# EAGLE design PAGE1 (EAGLE 9.6.0)
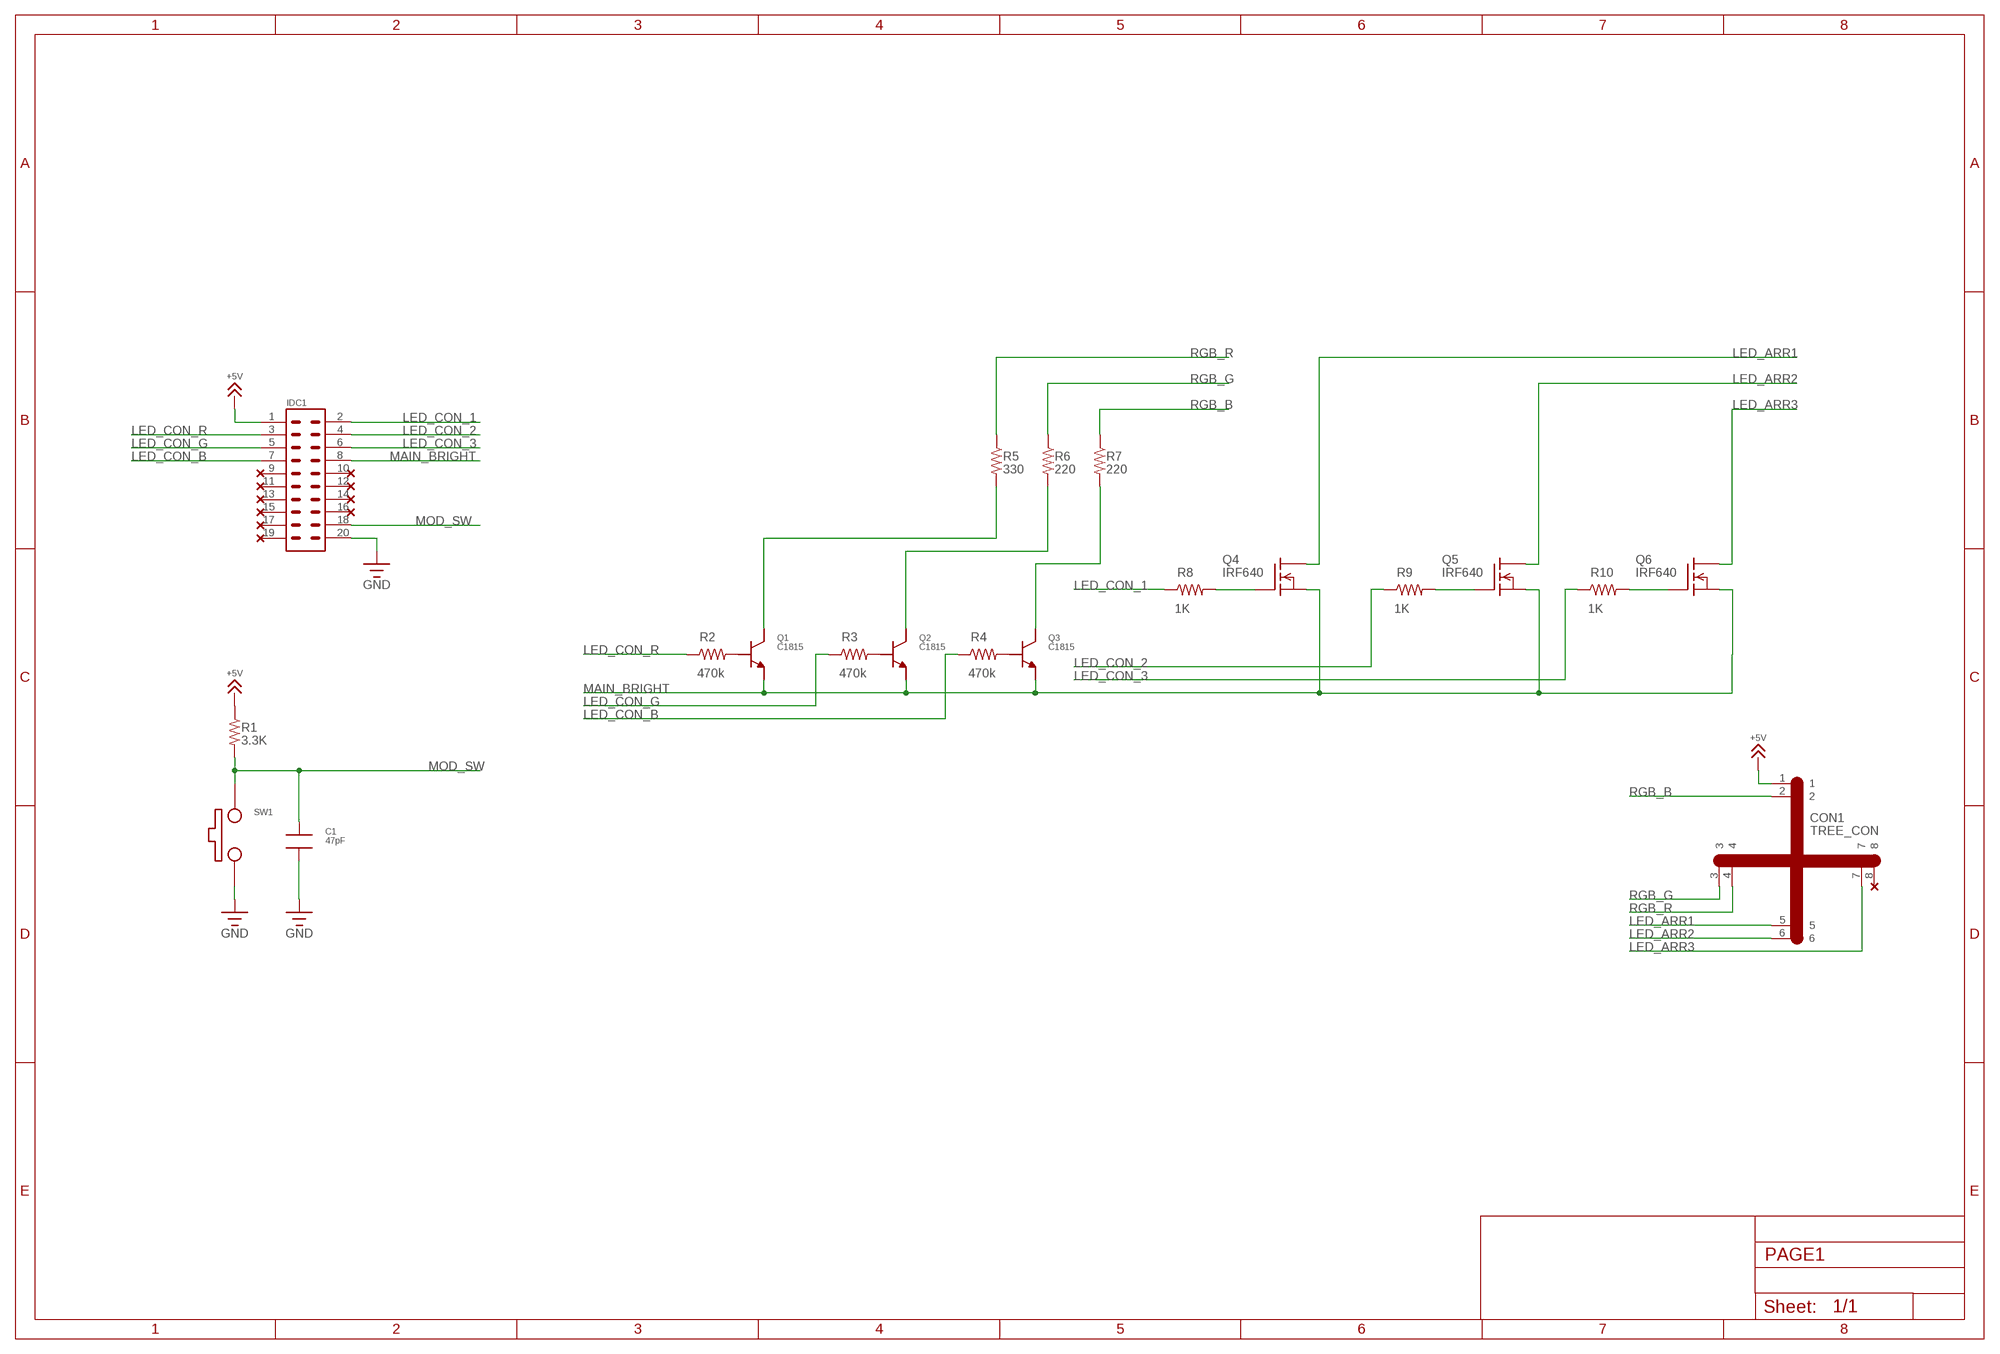
[diagram p0: schematic, sheet 1]

## Parts
C1  47pF  CAP_NP_SMD2012  [SMD2012]
CON1  TREE_CON  [TREE_CON]
IDC1  IDC20_BEN  [IDC20_BENDING]
Q1  C1815  NPN  [TO92]
Q2  C1815  NPN  [TO92]
Q3  C1815  NPN  [TO92]
Q4  IRF640  IRF620  [TO220]
Q5  IRF640  IRF620  [TO220]
Q6  IRF640  IRF620  [TO220]
R1  3.3K  RES_2012  [SMD2012]
R2  470k  RES_2012  [SMD2012]
R3  470k  RES_2012  [SMD2012]
R4  470k  RES_2012  [SMD2012]
R5  330  RES_2012  [SMD2012]
R6  220  RES_2012  [SMD2012]
R7  220  RES_2012  [SMD2012]
R8  1K  RES_2012  [SMD2012]
R9  1K  RES_2012  [SMD2012]
R10  1K  RES_2012  [SMD2012]
SW1  PUSH_SW  [PUSH_SW]

## Nets
+5V [POWER]: CON1.1 IDC1.1 R1.1
GND [POWER]: C1.2 IDC1.20 SW1.P$1
LED_ARR1: CON1.5 Q4.2(D)
LED_ARR2: CON1.6 Q5.2(D)
LED_ARR3: CON1.7 Q6.2(D)
LED_CON_1: IDC1.2 R8.1
LED_CON_2: IDC1.4 R9.1
LED_CON_3: IDC1.6 R10.1
LED_CON_B: IDC1.7 R4.1
LED_CON_G: IDC1.5 R3.1
LED_CON_R: IDC1.3 R2.1
MAIN_BRIGHT: IDC1.8 Q1.1(E) Q2.1(E) Q3.1(E) Q4.3(S) Q5.3(S) Q6.3(S)
MOD_SW: C1.1 IDC1.18 R1.2 SW1.P$2
N$13: Q4.1(G) R8.2
N$43: Q5.1(G) R9.2
N$46: Q6.1(G) R10.2
N$50: Q1.3(B) R2.2
N$53: Q2.3(B) R3.2
N$54: Q3.3(B) R4.2
N$55: Q1.2(C) R5.2
N$56: Q2.2(C) R6.2
N$57: Q3.2(C) R7.2
RGB_B: CON1.2 R7.1
RGB_G: CON1.3 R6.1
RGB_R: CON1.4 R5.1
Unconnected: CON1.8 IDC1.9 IDC1.10 IDC1.11 IDC1.12 IDC1.13 IDC1.14 IDC1.15 IDC1.16 IDC1.17 IDC1.19

## Library data of the parts
C1 = !JKS:CAP_NP
CON1 = !JKS:TREE_CON
IDC1 = !JKS:IDC20
Q1-Q3 = !JKS:NPN
Q4-Q6 = transistor-fet:IRF620: N-Channel Enhancement MOSFET (HEXFET); 200V; 5,2A; 0,8Ohm
R1-R10 = !JKS:RES
SW1 = !JKS:PUSH_SW

## Net classes
0 default: width 0.254 mm
1 POWER: width 0.3 mm

## Board
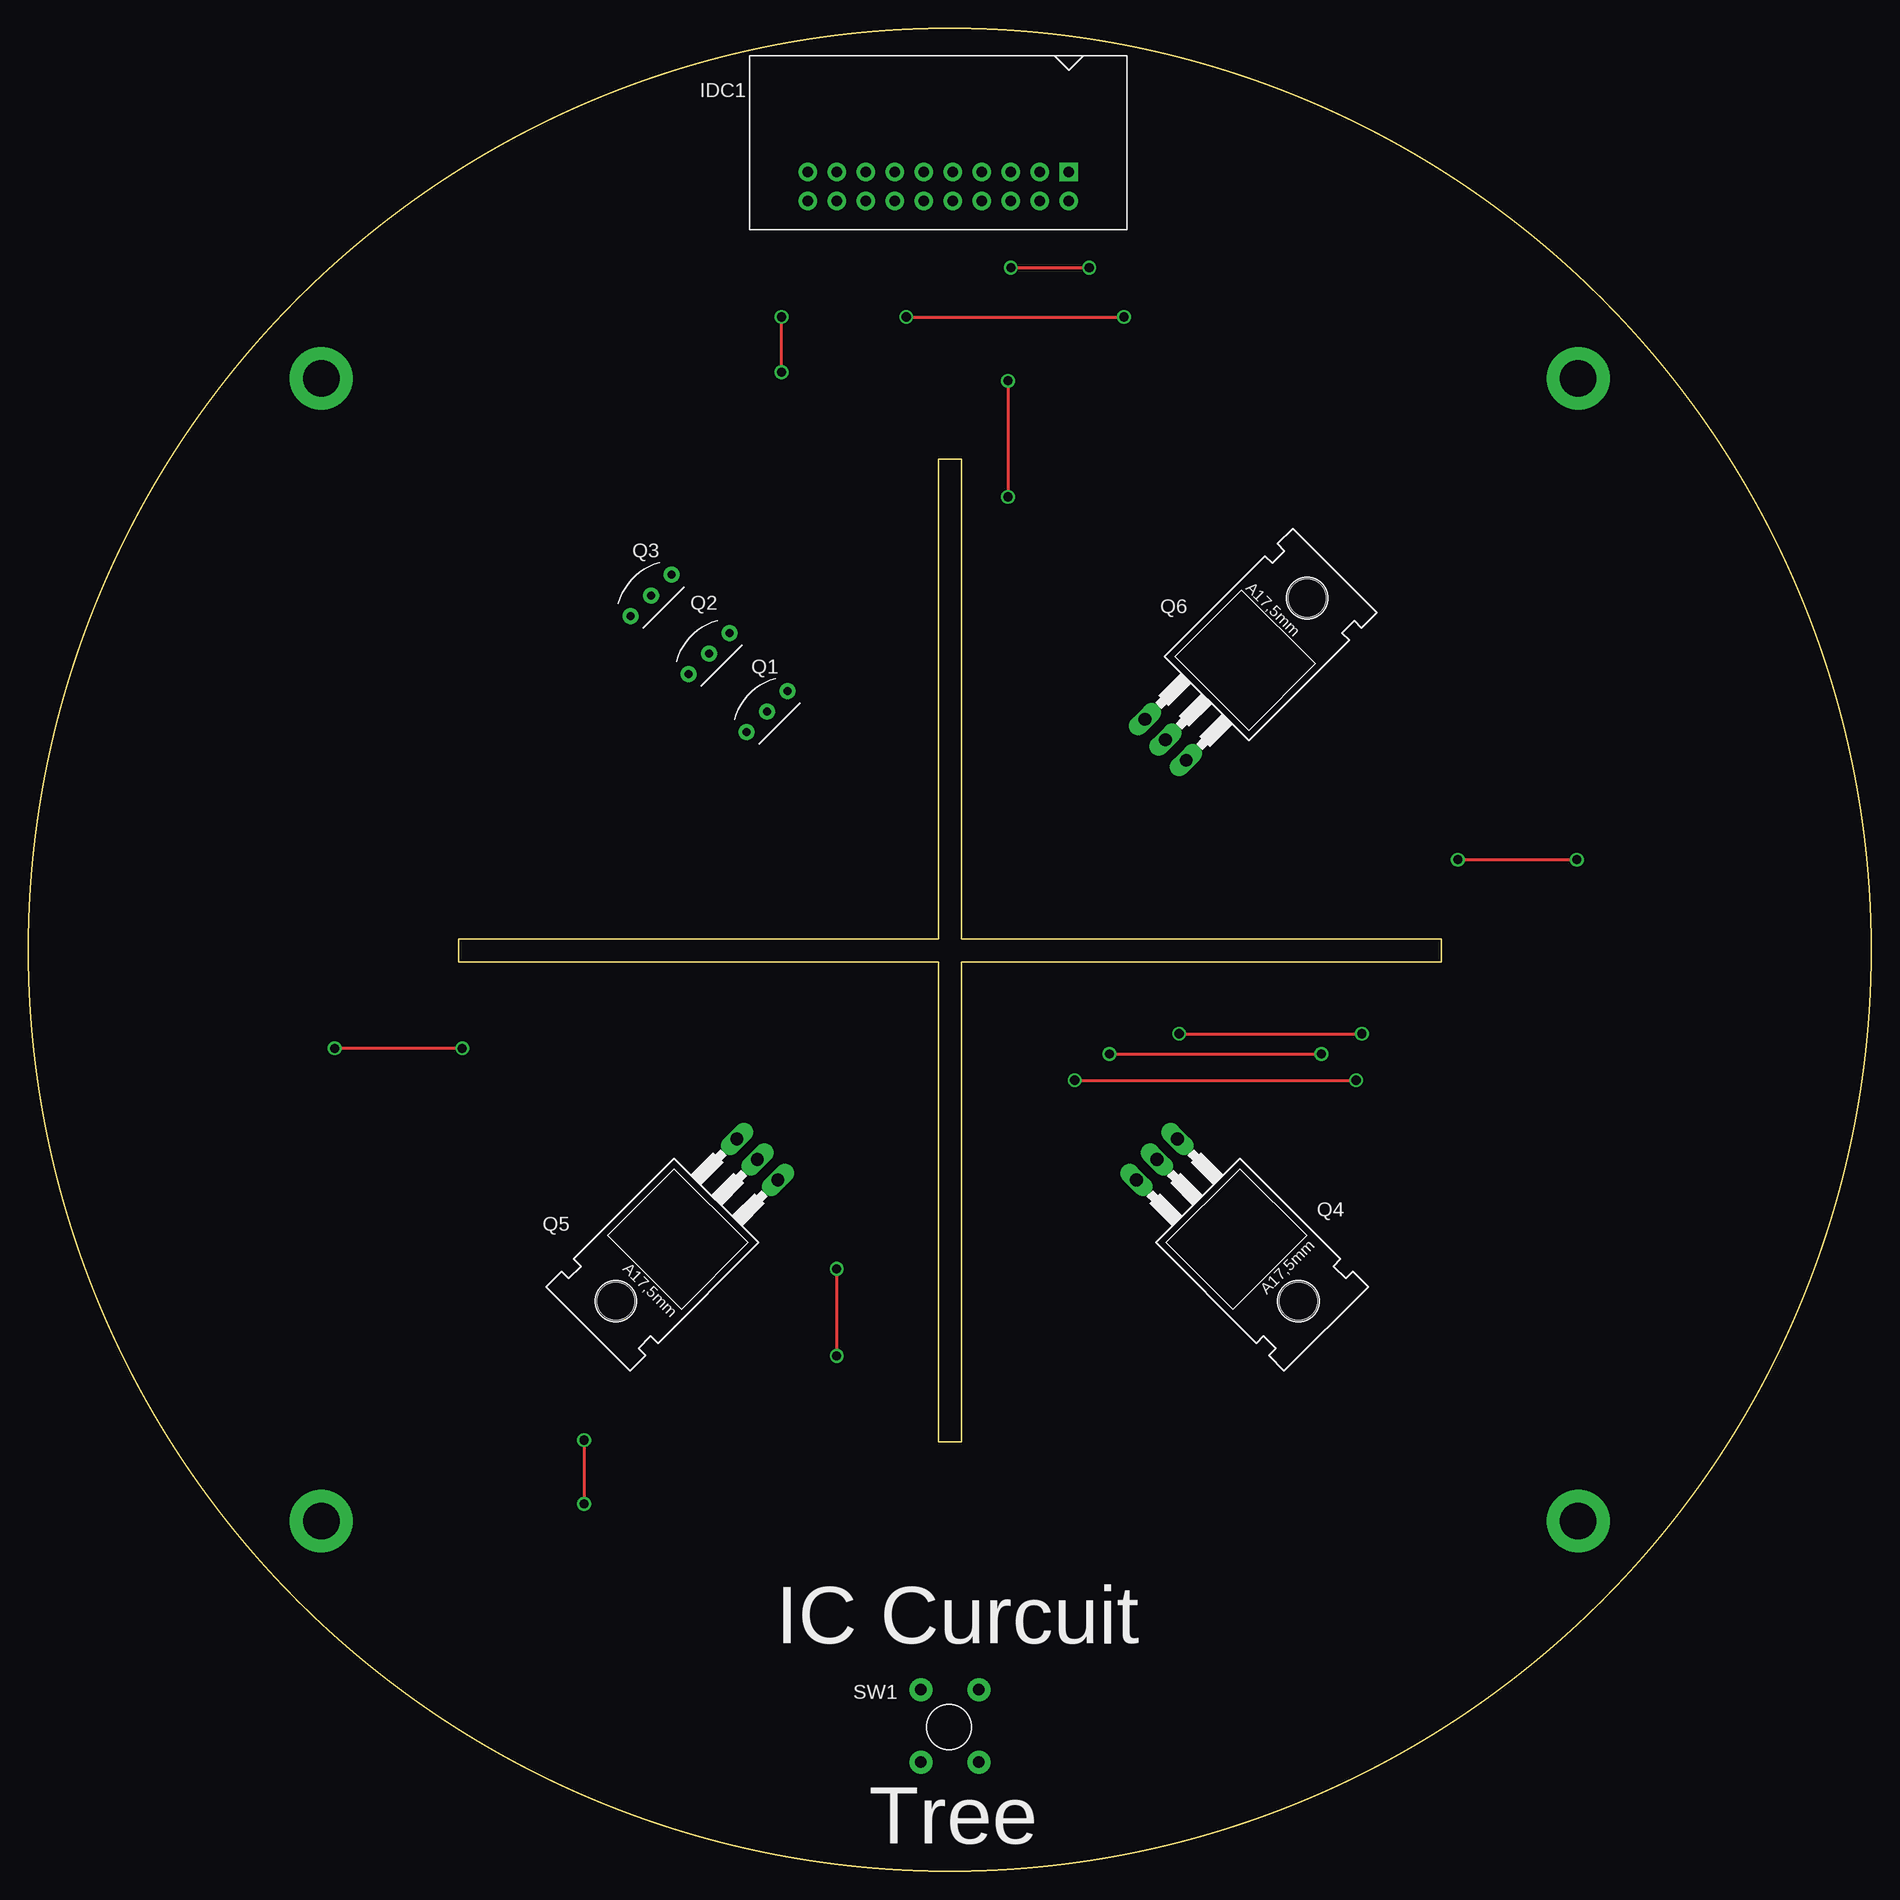
[diagram p1: board, top side]
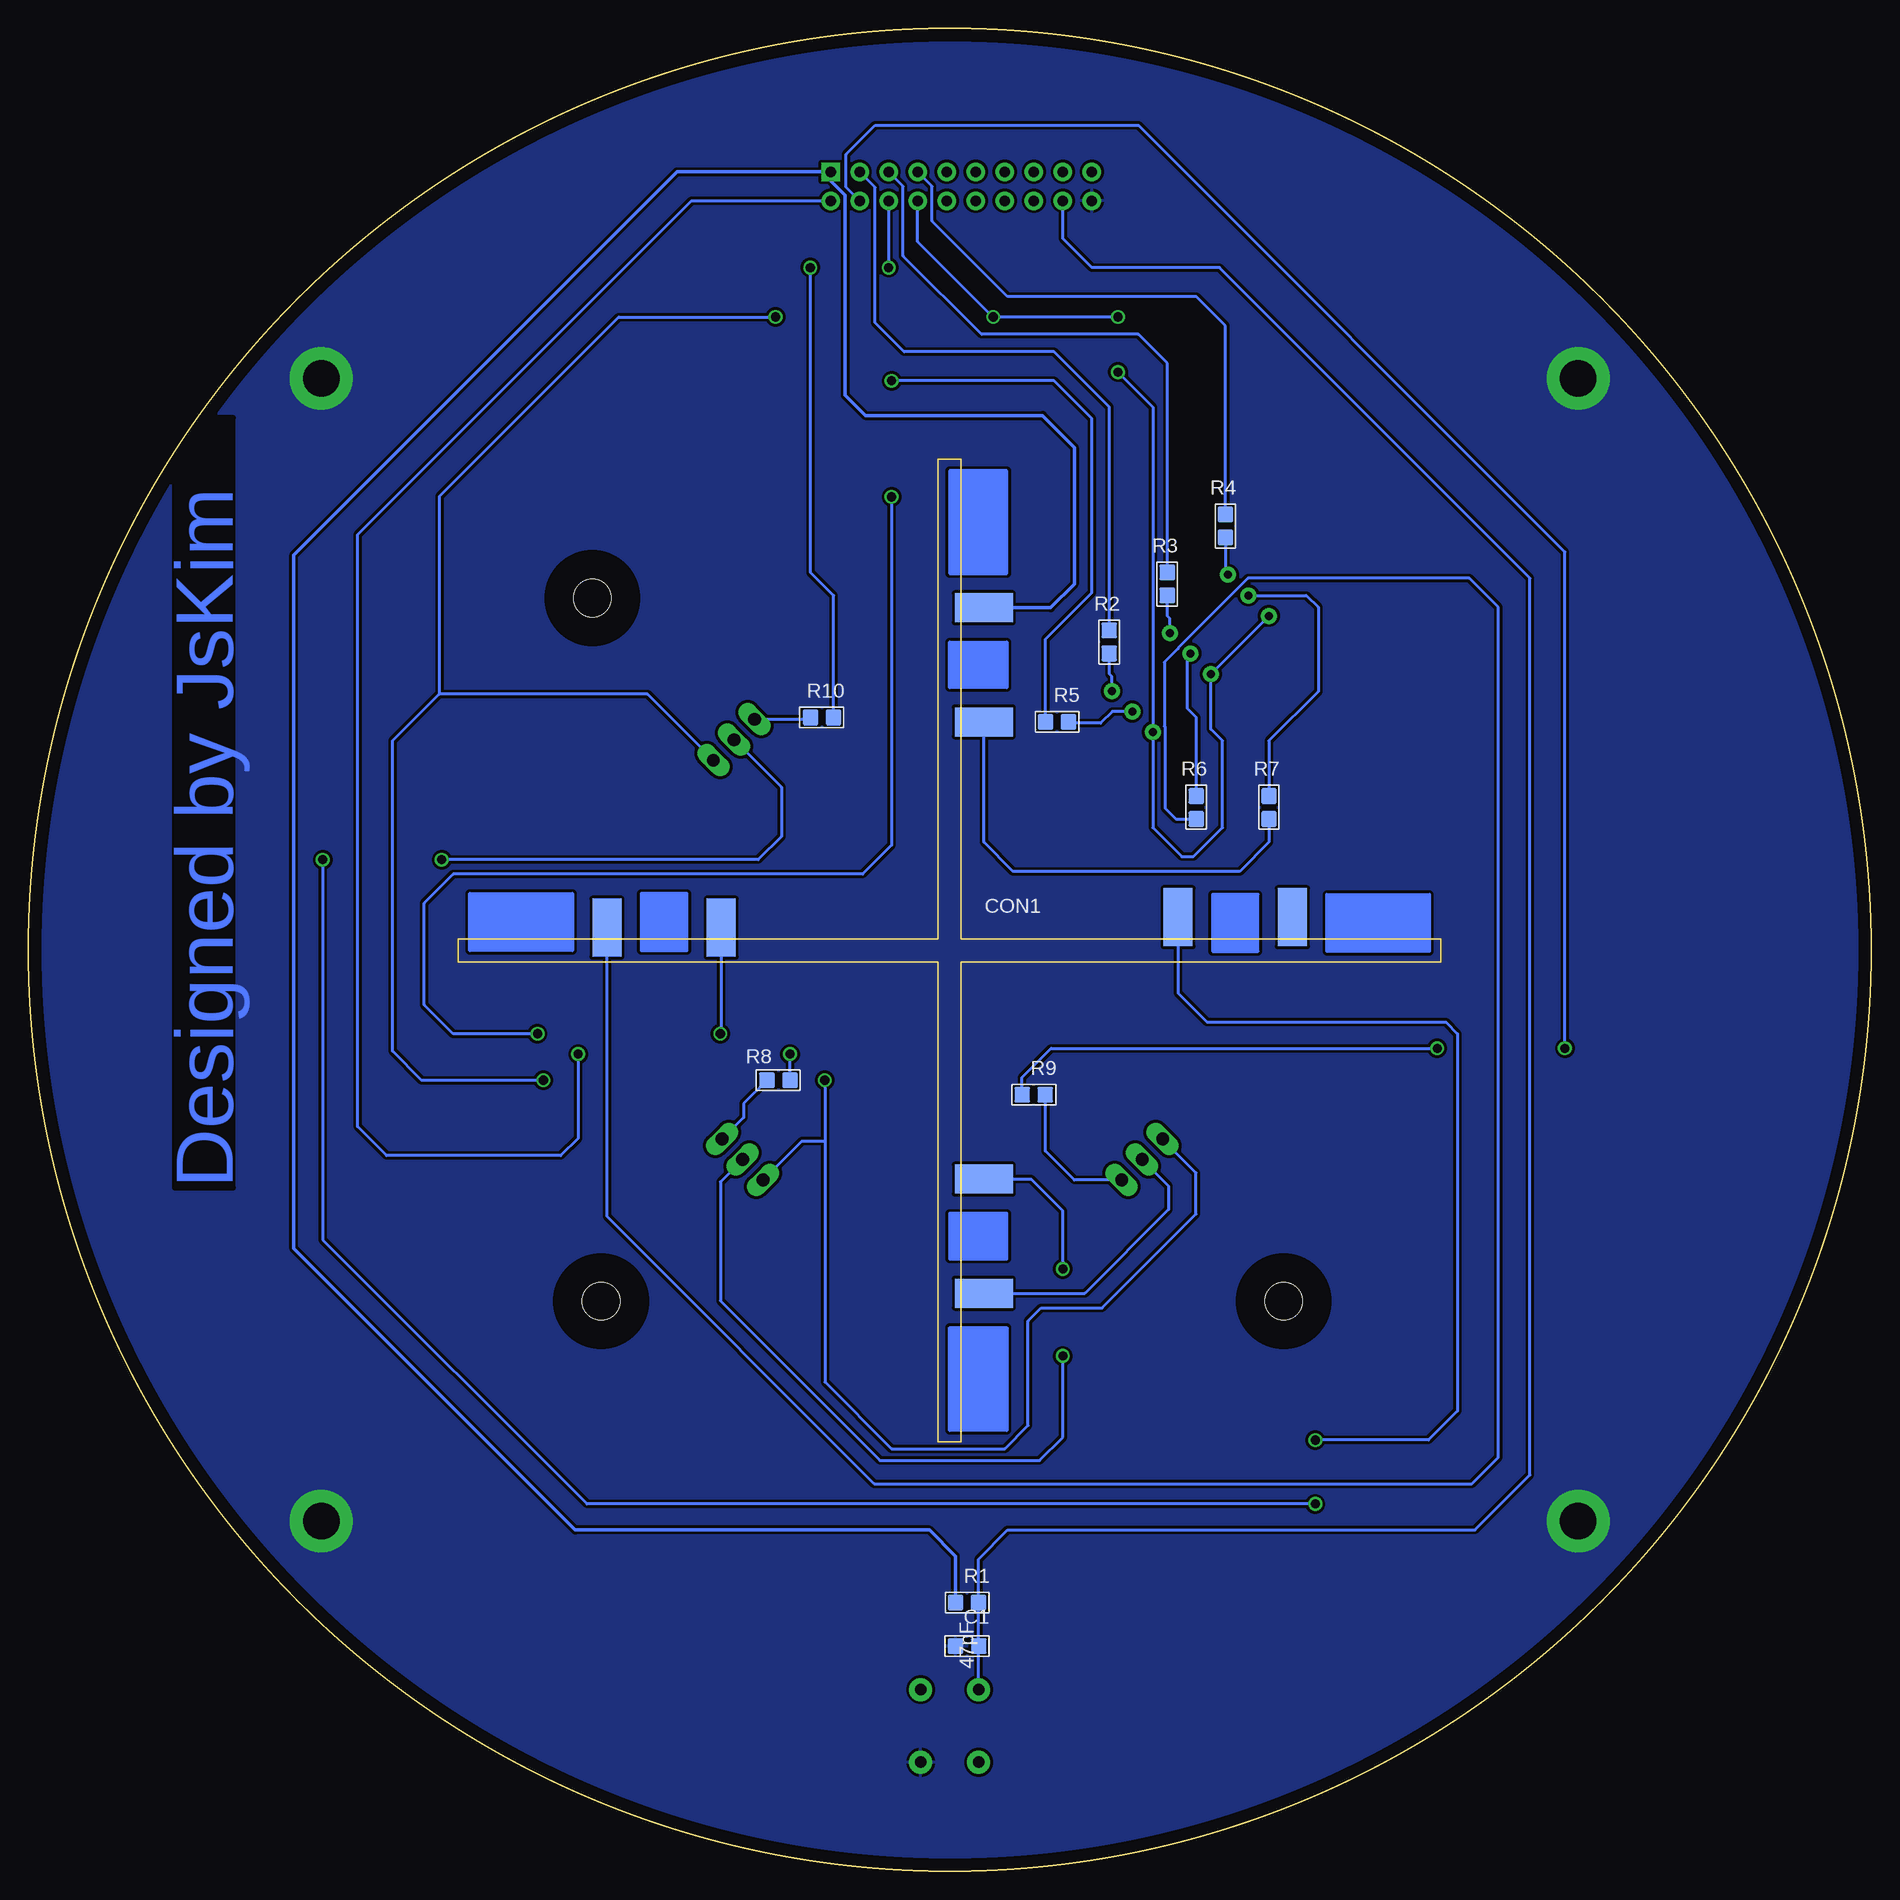
[diagram p2: board, bottom side, seen from below]

Size 161.25 x 161.25 mm. Coordinates in mm from the lower left corner, seen from the top.
Outline: circle at 80.62,80.62 radius 80.62
Copper layers (1*16): Top 0.035mm / dielectric 0.15mm / Bottom 0.035mm
Design rules "default *": minimum track width 10mil, minimum drill 0.35mm, track to track 10mil, track to pad 10mil, pad to pad 6mil, via to via 10mil, smd to smd 10mil, copper to edge 40mil, drill to drill 6mil, minimum pad ring 10mil, minimum via ring 8mil, stop-mask expansion 4mil, vias tented up to drill 0mil, thermal gap 10mil

### Footprints (pad centres in the part's own frame; a part is rotated, then mirrored left to right if it is on the bottom)
SMD2012 = smd 1.4 x 1.4: 1 0,0; 2 2.019,0
TREE_CON = smd 5.08 x 2.54: 1 3,30; 2 3,20; 5 3,-20; 6 3,-30 | smd 2.54 x 5.08: 3 -30,2; 4 -20,2; 7 20,2.92; 8 30,2.92
IDC20_BENDING = drill 0.9 pad 1.6 square: 1 0,0 | drill 0.9 pad 1.6: 2 2.54,0; 3 0,-2.54; 4 2.54,-2.54; 5 0,-5.08; 6 2.54,-5.08; 7 0,-7.62; 8 2.54,-7.62; 9 0,-10.16; 10 2.54,-10.16; 11 0,-12.7; 12 2.54,-12.7; 13 0,-15.24; 14 2.54,-15.24; 15 0,-17.78; 16 2.54,-17.78; 17 0,-20.32; 18 2.54,-20.32; 19 0,-22.86; 20 2.54,-22.86
TO92 = drill 0.7 pad 1.4: 1 0,0; 2 0,2.54; 3 0,5.08
TO220 = drill 1.118 long: 1 -2.54,-6.35; 2 0,-6.35; 3 2.54,-6.35 | hole 3.302: 0,11.176
PUSH_SW = drill 1 pad 2: P$1 0,6.35; P$2 5.08,0; P$3 0,0; P$4 5.08,6.35

### Placement (x,y rotation side)
C1  78.09,19.67 180 bottom
CON1  80.63,80.55 0 bottom
IDC1  91.05,148.7 270 top
Q1  62.85,99.68 315 top
Q2  57.77,104.76 315 top
Q3  52.69,109.84 315 top
Q4  103.24,57.77 225 top
Q5  59.3,57.77 135 top
Q6  104,103.49 315 top
R1  80.12,23.48 0 bottom
R2  66.66,108.57 270 bottom
R3  61.58,113.65 270 bottom
R4  56.5,118.73 270 bottom
R5  72.25,100.57 0 bottom
R6  59.04,92.06 90 bottom
R7  52.69,92.06 90 bottom
R8  94.6,69.2 180 bottom
R9  74.28,67.93 0 bottom
R10  90.79,100.95 180 bottom
SW1  83.17,15.86 180 top

### Tracks (layer width: path | path; a pad name or v marks a point on that pad's centre or on a via)
+5V
  Bottom 0.3: CON1.1 71.79,110.55 69.71,112.64 69.71,124.57 72.5,127.37 88,127.37 89.78,129.15 89.78,146.67 91.05,147.94 IDC1.1 104.51,148.7 138.04,115.18 138.04,54.47 113.4,29.83 82.41,29.83 80.12,27.55 R1.1
GND  (via drill 3.2 pad 5.5)
  other vias: 25.62,130.62 135.62,130.62 25.62,30.62 135.62,30.62
  pour Bottom: 0.62,75.62 0.62,80.62 arc-90 80.62,160.62 arc-90 160.62,80.62 160.62,75.62 arc-90 85.62,0.62 80.62,0.62 75.62,0.62 arc-90
LED_ARR1  (via drill 0.8 pad 0.7)
  Top 0.254: v70.73,52.69 v70.73,45.07
  Bottom 0.254: Q4.2 100.7,60.31 100.7,49.9 86.73,35.93 72.76,35.93 70.73,37.96 v70.73,45.07 | v70.73,52.69 70.73,57.77 73.51,60.55 CON1.5
LED_ARR2
  Bottom 0.254: CON1.6 68.8,50.55 61.47,57.88 61.47,59.95 Q5.2
LED_ARR3  (via drill 0.8 pad 0.7)
  Top 0.254: v125.08,88.51 v135.5,88.51 | v48.63,37.71 v48.63,32.12
  Bottom 0.254: Q6.2 95.36,94.86 95.36,90.54 97.4,88.51 v125.08,88.51 | v135.5,88.51 135.5,55.23 112.38,32.12 v48.63,32.12 | CON1.7 60.63,76.82 58.09,74.28 37.2,74.28 36.18,73.27 36.18,40.25 38.72,37.71 v48.63,37.71
LED_CON_1  (via drill 0.8 pad 0.7)
  Top 0.254: v94.6,71.49 v113.14,71.49
  Bottom 0.254: R8.1 v94.6,71.49 | v113.14,71.49 113.14,64.12 114.67,62.6 129.91,62.6 132.45,65.14 132.45,116.95 103.24,146.16 IDC1.2
LED_CON_2  (via drill 0.8 pad 0.7)
  Top 0.254: v37.96,72 v26.78,72
  Bottom 0.254: R9.1 74.28,69.46 71.74,72 v37.96,72 | v26.78,72 26.78,115.43 64.12,152.77 87.15,152.77 89.69,150.23 89.69,147.35 IDC1.4
LED_CON_3  (via drill 0.8 pad 0.7)
  Top 0.254: v85.97,140.32 v92.82,140.32
  Bottom 0.254: IDC1.6 v85.97,140.32 | v92.82,140.32 92.82,124.32 92.82,113.65 90.79,111.62 R10.1
LED_CON_B
  Bottom 0.254: R4.1 56.5,135.24 59.04,137.78 75.55,137.78 82.16,144.39 82.16,147.43 IDC1.7
LED_CON_G
  Bottom 0.254: R3.1 61.58,131.94 64.12,134.48 77.84,134.48 84.7,141.34 84.7,147.43 IDC1.5
LED_CON_R
  Bottom 0.254: R2.1 66.66,128.13 71.49,132.96 84.61,132.96 87.15,135.5 87.15,147.35 IDC1.3
MAIN_BRIGHT  (via drill 0.8 pad 0.7)
  Top 0.254: v65.9,131.18 v65.9,136 | v91.55,69.2 v116.19,69.2 | v76.82,136 v95.87,136
  Bottom 0.254: v65.9,131.18 62.85,128.13 Q1.1 62.85,91.3 60.31,88.76 59.3,88.76 56.76,91.3 56.76,98.92 57.77,99.94 Q2.1 Q3.1 | v65.9,136 v76.82,136 83.43,142.61 IDC1.8 | v116.19,69.2 126.86,69.2 129.4,71.74 129.4,98.92 125.27,103.05 | 125.27,103.05 125.27,102.98 107.08,102.98 Q6.3 | 125.27,103.05 125.27,120.32 109.59,136 v95.87,136 | v91.55,69.2 91.55,63.87 | 91.55,63.87 91.55,42.79 85.71,36.94 75.81,36.94 73.77,38.98 73.77,48.12 72.63,49.26 67.3,49.26 59.06,57.5 59.06,61.09 61.99,64.02 Q5.3 | Q4.3 93.55,63.87 91.55,63.87
MOD_SW
  Bottom 0.254: SW1.P$2 C1.1 78.09,23.47 R1.2 78.11,27.29 75.57,29.83 34.66,29.83 29.83,34.66 29.83,113.14 57.01,140.32 68.19,140.32 70.73,142.86 IDC1.18
N$13
  Bottom 0.254: R8.2 98.67,67.16 98.67,65.94 Q4.1
N$43
  Bottom 0.254: Q5.1 69.72,60.47 72.26,63.01 R9.2
N$46
  Bottom 0.254: Q6.1 92.97,100.8 R10.2
N$50
  Bottom 0.254: Q1.3 66.44,104.54 66.66,104.76 R2.2
N$53
  Bottom 0.254: Q2.3 61.36,109.62 61.58,109.84 R3.2
N$54
  Bottom 0.254: R4.2 56.5,113.65 Q3.3
N$55
  Bottom 0.254: Q1.2 66.39,101.48 67.42,100.44 70.1,100.44 R5.2
N$56
  Bottom 0.254: R6.2 59.04,100.95 59.8,101.71 59.8,106.32 Q2.2
N$57
  Bottom 0.254: R7.2 52.69,98.92 48.37,103.24 48.37,110.6 49.41,111.64 Q3.2
RGB_B
  Bottom 0.254: R7.1 52.69,90.03 55.23,87.49 75.09,87.49 77.63,90.03 CON1.2
RGB_G
  Bottom 0.254: CON1.3 110.63,57.29 87.24,33.9 34.91,33.9 32.63,36.18 32.63,110.6 35.17,113.14 54.51,113.14 60.65,107.01 60.65,106.97 61.84,105.78 61.84,100.2 61.77,100.13 61.77,93.01 60.82,92.06 R6.1
RGB_R  (via drill 0.8 pad 0.7)
  Top 0.254: v85.71,130.42 v85.71,120.26 | v100.7,73.27 v116.7,73.27
  Bottom 0.254: R5.1 72.25,107.81 68.19,111.87 68.19,127.11 71.49,130.42 v85.71,130.42 | v85.71,120.26 85.71,89.78 88.25,87.24 124.07,87.24 126.61,84.7 126.61,75.81 124.07,73.27 v116.7,73.27 | CON1.4 100.63,73.33 v100.7,73.27

### Text on the board
Bottom: Designed by JsKim
tPlace: IC Curcuit | Tree